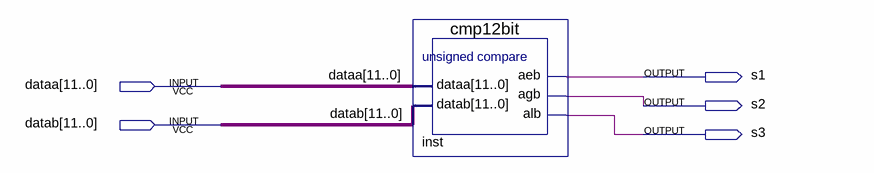
[diagram p0: schematic sheet]
// Quartus schematic pruebaComparador.bdf as structural Verilog: 1 symbols, 5 pins
module pruebaComparador (
  input  [11:0] dataa,
  input  [11:0] datab,
  output s1,
  output s2,
  output s3
);

  cmp12bit inst (.dataa(dataa), .datab(datab), .aeb(s1), .agb(s2), .alb(s3));
endmodule
